# Altium schematic sheet PCB_Schematic_Sheet_1.SchDoc
size A4
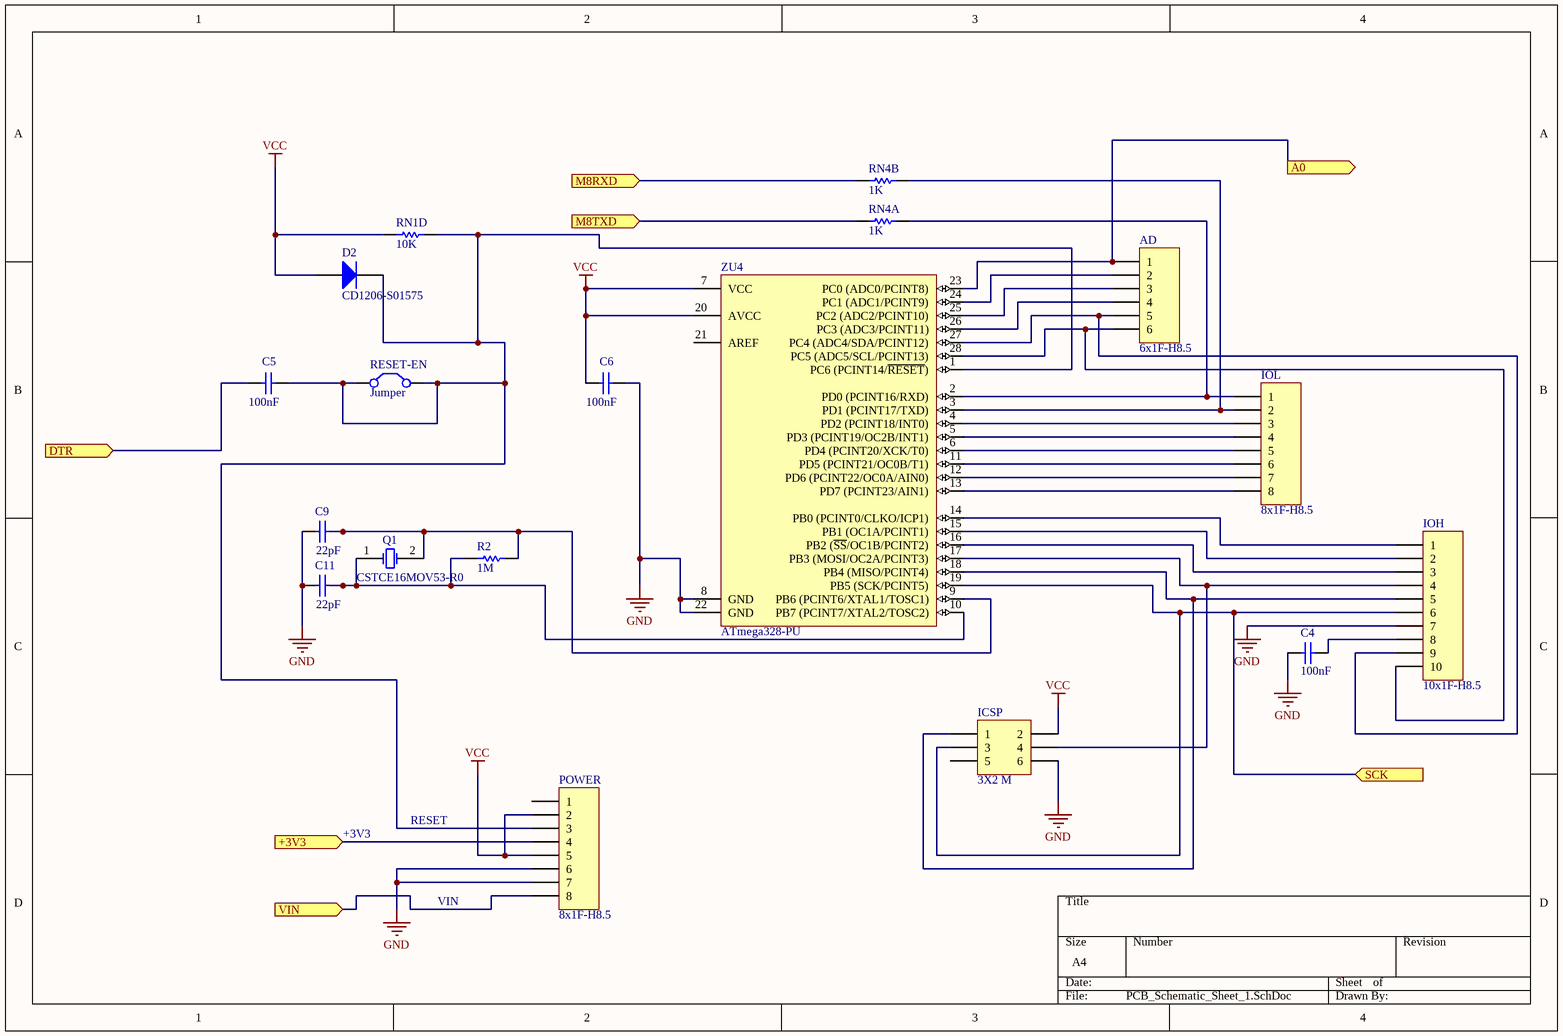
[diagram p0: PCB_Schematic_Sheet_1.SchDoc]

## Parts
AD  6x1F-H8.5  [HDR1X6]
C4  100nF  [CAPC0805(2012)100_M]
C5  100nF  [CAPC0805(2012)100_M]
C6  100nF  [CAPC0805(2012)100_M]
C9  22pF  [CAPC0805(2012)100_M]
C11  22pF  [CAPC0805(2012)100_M]
D2  CD1206-S01575  [BOUR-CD1206-S01575-2_L]
ICSP  3X2 M  [HDR2X3]
IOH  10x1F-H8.5  [HDR1X10]
IOL  8x1F-H8.5  [HDR1X8]
POWER  8x1F-H8.5  [HDR1X8]
Q1  CSTCE16MOV53-R0  [R38]
R2  1M  [RESC0805(2012)_N]
RESET-EN  Jumper  [RAD-0.2]
RN1D  10K  [RESC0805(2012)_M]
RN4A  1K  [RESC0805(2012)_M]
RN4B  1K  [RESC0805(2012)_M]
ZU4  ATmega328-PU  [28P3]

## Ports
+3V3 (in), A0 (out), DTR (in), M8RXD (in), M8TXD (in), SCK (in), VIN (in)

## Nets
GND: C4.1 C6.2 C9.1 C11.1 ICSP.6 IOH.7 POWER.6 POWER.7 ZU4.8(GND) ZU4.22(GND)
VCC: C6.1 D2.1(A) ICSP.2 POWER.2 POWER.5 RN1D.1 ZU4.7(VCC) ZU4.20(AVCC)
+3V3: POWER.4 ; port +3V3
A0: AD.1 ZU4.23(PC0_(ADC0/PCINT8)) ; port A0
DTR: C5.1 ; port DTR
M8RXD: RN4B.1 ; port M8RXD
M8TXD: RN4A.1 ; port M8TXD
SCK: ICSP.3 IOH.6 ZU4.19(PB5_(SCK/PCINT5)) ; port SCK
VIN: POWER.8 ; port VIN
NetAD_2: AD.2 ZU4.24(PC1_(ADC1/PCINT9))
NetAD_3: AD.3 ZU4.25(PC2_(ADC2/PCINT10))
NetAD_4: AD.4 ZU4.26(PC3_(ADC3/PCINT11))
NetAD_5: AD.5 IOH.9 ZU4.27(PC4_(ADC4/SDA/PCINT12))
NetAD_6: AD.6 IOH.10 ZU4.28(PC5_(ADC5/SCL/PCINT13))
NetC4_2: C4.2 IOH.8
NetC5_2: C5.2 D2.2(K) POWER.3 RESET-EN.1(C1) RESET-EN.2(C2) RN1D.2 ZU4.1(PC6_(PCINT14/~{RESET}))
NetC9_2: C9.2 Q1.2(OSC2) R2.2 ZU4.9(PB6_(PCINT6/XTAL1/TOSC1))
NetC11_2: C11.2 Q1.1(OSC1) R2.1 ZU4.10(PB7_(PCINT7/XTAL2/TOSC2))
NetICSP_1: ICSP.1 IOH.5 ZU4.18(PB4_(MISO/PCINT4))
NetICSP_4: ICSP.4 IOH.4 ZU4.17(PB3_(MOSI/OC2A/PCINT3))
NetIOH_1: IOH.1 ZU4.14(PB0_(PCINT0/CLKO/ICP1))
NetIOH_2: IOH.2 ZU4.15(PB1_(OC1A/PCINT1))
NetIOH_3: IOH.3 ZU4.16(PB2_(~{SS}/OC1B/PCINT2))
NetIOL_1: IOL.1 RN4A.2 ZU4.2(PD0_(PCINT16/RXD))
NetIOL_2: IOL.2 RN4B.2 ZU4.3(PD1_(PCINT17/TXD))
NetIOL_3: IOL.3 ZU4.4(PD2_(PCINT18/INT0))
NetIOL_4: IOL.4 ZU4.5(PD3_(PCINT19/OC2B/INT1))
NetIOL_5: IOL.5 ZU4.6(PD4_(PCINT20/XCK/T0))
NetIOL_6: IOL.6 ZU4.11(PD5_(PCINT21/OC0B/T1))
NetIOL_7: IOL.7 ZU4.12(PD6_(PCINT22/OC0A/AIN0))
NetIOL_8: IOL.8 ZU4.13(PD7_(PCINT23/AIN1))

Not connected (* = marked no-connect by the designer): ICSP 5; POWER 1; ZU4 21(AREF)

## Notes on the sheet
- +3V3
- RESET
- VIN

## Library data of the parts
AD = Header 6: Header, 6-Pin; LatestRevisionDate: 17-Jul-2002; LatestRevisionNote: Re-released for DXP Platform.; Publisher: Altium Limited
C4-C6 = CMP-1036-04420-1: CAP 100nF 50V ±10% 0805 (2012 Metric) Thickness 1mm SMD; Case-EIA: 0805; Tolerance: Â±10%; Case-Metric: 2012; Rated Voltage: 50 V; Value: 100nF; Max Thickness: 1 mm; Technology: SMT
C9 C11 = CMP-1036-01242-1: CAP 22pF 50V ±5% 0805 (2012 Metric) Thickness 1mm SMD; Tolerance: Â±5%; Case-EIA: 0805; Case-Metric: 2012; Value: 22pF; Rated Voltage: 50 V; Max Thickness: 1 mm; Technology: SMT
D2 = CMP-0583-00001-2: 75 V Small Signal Switching Diode, 150 mA, 2.5 uA, 1026 Molded Package, RoHS, Tape and Reel; Manufacturer: Bourns; Reverse Voltage: 75 V; Average Forward Current: 150 mA; Reverse Current (Max.): 2.5 uA; Capacitance Between Terminals (Max.): 3 pF; Reverse Recovery Time (Max.): 4 nS; Forward Voltage (Max.): 1.00 V; Packing: Tape and Reel; Mounting Technology: Surface Mount; DatasheetVersion: Rev. 06/11; ComponentLink2URL: http://www.bourns.com/data/global/pdfs/CD1206_S01575.pdf; PackageReference: CD1206-S01575-2; RoHS: TRUE; ComponentLink1URL: http://www.bourns.com/; ComponentLink1Description: Manufacturer URL; ComponentLink3Description: Package Specification; ComponentLink3URL: http://www.bourns.com/data/global/pdfs/CD1206_S01575.pdf; ComponentLink2Description: Datasheet; PackageDescription: 2-Pin SMD, Body 3.2 x 1.5 mm; PartNumber: CD1206-S01575
ICSP = Header 3X2: Header, 3-Pin, Dual row; LatestRevisionDate: 17-Jul-2002; LatestRevisionNote: Re-released for DXP Platform.; Publisher: Altium Limited
IOH = Header 10: Header, 10-Pin; LatestRevisionDate: 17-Jul-2002; LatestRevisionNote: Re-released for DXP Platform.; Publisher: Altium Limited
IOL POWER = Header 8: Header, 8-Pin; LatestRevisionDate: 17-Jul-2002; LatestRevisionNote: Re-released for DXP Platform.; Publisher: Altium Limited
Q1 = XTAL: Crystal Oscillator; Published: 8-Jun-2000; LatestRevisionDate: 17-Jul-2002; LatestRevisionNote: Re-released for DXP Platform.; PackageReference: R38; Publisher: Altium Limited; PackageDescription: Crystal, Thru-Hole; 2 Leads; Body 3.1 x 8.2 mm (Dia.xH)
R2 = CMP-1013-00849-1: 1M 0.125W 1% 0805 (2012 Metric)  SMD; Value: 1000000.00 Ohm; Case-Metric: 2012; Case-EIA: 0805; Technology: SMT; Power: 0.125 W; Tolerance: 1 %
RESET-EN = Jumper: Jumper Wire; Published: 24-Mar-1999; LatestRevisionDate: 17-Jul-2002; LatestRevisionNote: Re-released for DXP Platform.; PackageReference: RAD-0.2; Publisher: Altium Limited; PackageDescription: Radial Cap, Thru-Hole; 2 Leads; 0.2 in Pin Spacing
RN1D = CMP-1013-00623-1: 10K 0.125W 1% 0805 (2012 Metric)  SMD; Value: 10000.00 Ohm; Case-Metric: 2012; Case-EIA: 0805; Tolerance: 1 %; Power: 0.125 W; Technology: SMT
RN4A RN4B = CMP-1013-00510-1: 1K 0.125W 1% 0805 (2012 Metric)  SMD; Case-Metric: 2012; Value: 1000.00 Ohm; Case-EIA: 0805; Tolerance: 1 %; Power: 0.125 W; Technology: SMT
ZU4 = CMP-0095-00015-2: 8-bit AVR Microcontroller, 32KB Flash, 1KB EEPROM, 2KB SRAM, 28-pin PDIP, Industrial Grade (-40°C to 85°C); ComponentLink3Description: ATmega48A/48PA/88A/88PA/168A/168PA/328/328P Summary; RevisionNote: DatasheetVersion updated. URLs added.; DatasheetVersion: revD, May-2011; ComponentLink1URL: http://www.atmel.com/; PackageVersion: revB, Sep-2001; PackageDescription: 28-lead (0.300"/7.62mm Wide) Plastic Dual Inline Package (PDIP); PackageReference: 28P3; ComponentLink1Description: Manufacturer URL; ComponentLink2Description: ATmega48A/48PA/88A/88PA/168A/168PA/328/328P Datasheet; ComponentLink3URL: http://www.atmel.com/dyn/resources/prod_documents/8271S.pdf; ComponentLink2URL: http://www.atmel.com/dyn/resources/prod_documents/8271.pdf